# EAGLE design OpAmpBreakout-fragmentC (EAGLE 6.4)
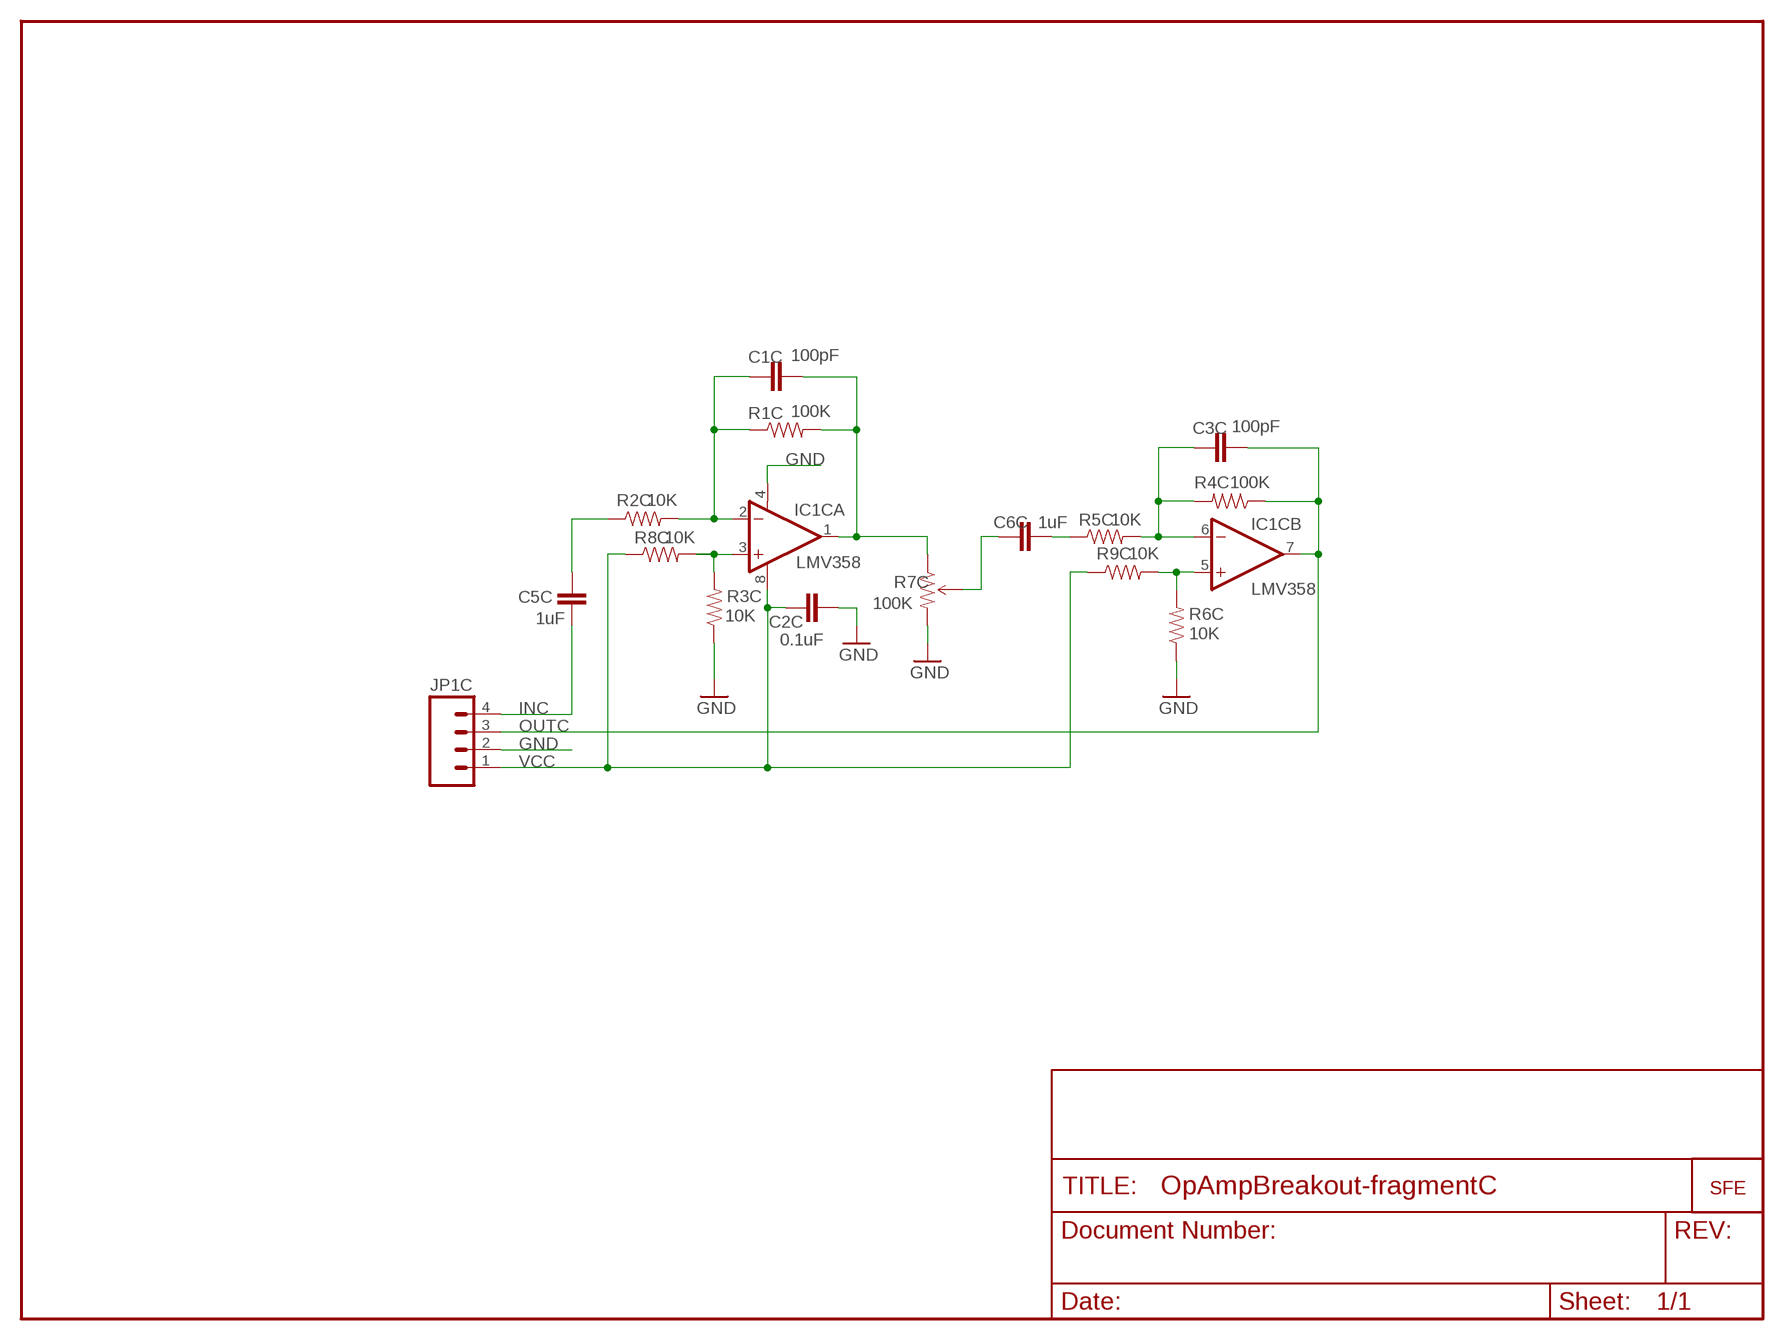
[diagram p0: schematic, sheet 1]

## Parts
C1C  100pF  CAP0402  [C0402]
C2C  0.1uF  CAP0402  [C0402]
C3C  100pF  CAP0402  [C0402]
C5C  1uF  CAP0402  [C0402]
C6C  1uF  CAP0402  [C0402]
IC1C  LMV358  OPAMP-DUALU  [SO08]
JP1C  M04PTH  [1X04]
R1C  100K  RESISTOR0402  [C0402]
R2C  10K  RESISTOR0402  [C0402]
R3C  10K  RESISTOR0402  [C0402]
R4C  100K  RESISTOR0402  [C0402]
R5C  10K  RESISTOR0402  [C0402]
R6C  10K  RESISTOR0402  [C0402]
R7C  100K  TRIMPOTSMD  [TRIMPOT-3MM]
R8C  10K  RESISTOR0402  [C0402]
R9C  10K  RESISTOR0402  [C0402]
U$3C  LOGO-SFENEW  [SFE-NEW-WEBLOGO]

## Nets
GND: C2C.2 IC1C.4(A:V-) JP1C.2 R3C.1 R6C.1 R7C.3(CW)
IN1C: C5C.2 R2C.1
INC: C5C.1 JP1C.4
N$1C: IC1C.5(B:+IN) R6C.2 R9C.2
N$2C: C1C.1 IC1C.2(A:-IN) R1C.1 R2C.2
N$3C: IC1C.3(A:+IN) R3C.2 R8C.2
N$4C: C6C.1 R5C.1
N$5C: C6C.2 R7C.2(WIPER)
N$7C: C3C.1 IC1C.6(B:-IN) R4C.2 R5C.2
OUT1C: C1C.2 IC1C.1(A:OUT) R1C.2 R7C.1(CCW)
OUTC: C3C.2 IC1C.7(B:OUT) JP1C.3 R4C.1
VCC: C2C.1 IC1C.8(A:V+) JP1C.1 R8C.1 R9C.1

## Library data of the parts
C1C C2C C3C C5C C6C = SparkFun:CAP: Capacitor Standard 0603 ceramic capacitor, and 0.1" leaded capacitor.
IC1C = SparkFun:OPAMP-DUAL: Operational Amplifier
JP1C = SparkFun:M04: Header 4 Standard 4-pin 0.1" header. Use with straight break away headers (SKU : PRT-00116), right angle break away headers (PRT-00553), swiss pins (PRT-00743), machine pins (PRT-00117), and female headers (PRT-00115). Molex polarized connector foot print use with SKU : PRT-08231 with associated crimp pins and housings.
R1C R2C R3C R4C R5C R6C = SparkFun:RESISTOR: Resistor Basic schematic elements and footprints for 0603, 1206, and PTH 1/10th watt (small) resistors.
R7C = SparkFun:TRIMPOT
R8C R9C = SparkFun-DC:RESISTOR: Resistor Basic schematic elements and footprints for 0603, 1206, and PTH 1/10th watt (small) resistors.
U$3C = SparkFun:LOGO-SFE: Spark Fun Electronics PCB Logo This is the standard Spark Fun Electronics PCB logo.

## Board
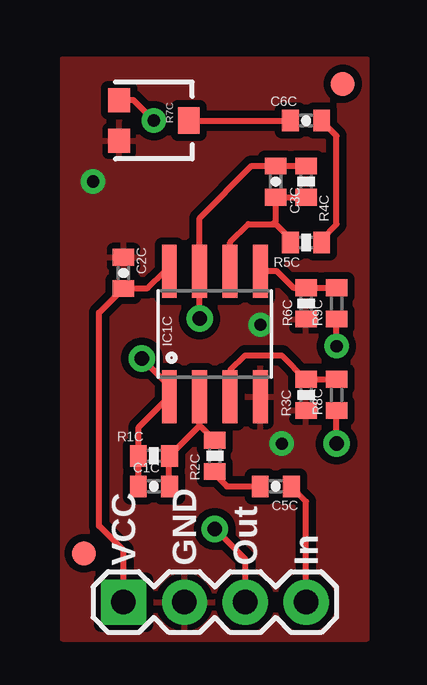
[diagram p1: board, top side]
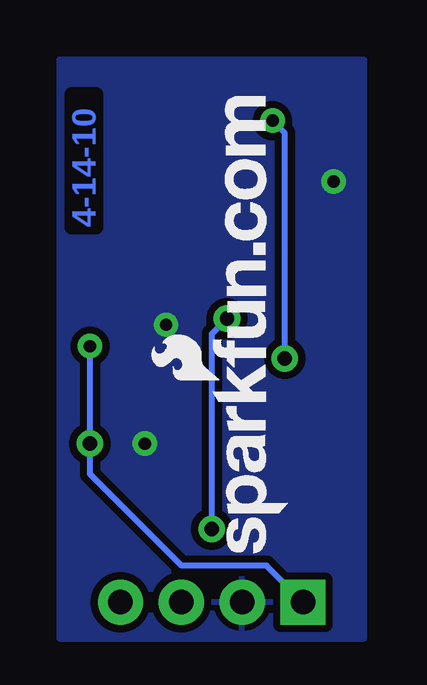
[diagram p2: board, bottom side, seen from below]

No outline drawn. Coordinates in mm, seen from the top.
Copper layers (1*16): Top 0.035mm / dielectric 1.5mm / Bottom 0.035mm
Design rules "SparkFun": minimum track width 8mil, minimum drill 20mil, track to track 8mil, track to pad 8mil, pad to pad 8mil, via to via 8mil, smd to smd 8mil, copper to edge 10mil, drill to drill 8mil, minimum pad ring 12mil, minimum via ring 10mil, stop-mask expansion 4mil, vias tented up to drill 25mil, thermal gap 10mil

### Footprints (pad centres in the part's own frame; a part is rotated, then mirrored left to right if it is on the bottom)
0402-CAP = smd 0.7 x 0.9: 1 -0.65,0; 2 0.65,0
FIDUCIAL-1X2 = smd 1 x 1: 1 0,0
SO08 = smd 0.61 x 2.21: 1 -1.905,-2.616; 2 -0.635,-2.616; 3 0.635,-2.616; 4 1.905,-2.616; 5 1.905,2.616; 6 0.635,2.616; 7 -0.635,2.616; 8 -1.905,2.616
1X04 = drill 1.016 pad 1.88 square: 1 0,0 | drill 1.016 pad 1.88: 2 2.54,0; 3 5.08,0; 4 7.62,0
0402-RES = smd 0.7 x 0.9: 1 -0.65,0; 2 0.65,0
TRIMPOT-3MM = smd 1 x 0.9: 1 -0.85,-1.45; 3 0.85,-1.45 | smd 1.1 x 0.9: 2 0,1.45
C0402 = smd 0.7 x 0.9: 1 -0.65,0; 2 0.65,0

### Placement (x,y rotation side)
C1C  100pF  [0402-CAP]  3.81,6.35 180 top
C2C  0.1uF  [0402-CAP]  2.54,15.24 90 top
C3C  100pF  [0402-CAP]  8.89,19.05 90 top
C5C  1uF  [0402-CAP]  8.89,6.35 180 top
C6C  1uF  [0402-CAP]  10.16,21.59 180 top
E$1C  [FIDUCIAL-1X2]  11.68,23.11 0 top
E$2C  [FIDUCIAL-1X2]  0.89,3.56 0 top
IC1C  6.35,12.7 0 top
JP1C  2.54,1.52 0 top
R1C  100K  [0402-RES]  3.81,7.62 180 top
R2C  10K  [0402-RES]  6.35,7.62 90 top
R3C  10K  [0402-RES]  10.16,10.16 90 top
R4C  100K  [0402-RES]  10.16,19.05 270 top
R5C  10K  [0402-RES]  10.16,16.51 180 top
R6C  10K  [0402-RES]  10.16,13.97 90 top
R7C  3.81,21.59 270 top
R8C  11.43,10.16 90 top
R9C  11.43,13.97 90 top
U$3C  3.17,3.57 90 bottom

### Tracks (layer width: path | path; a pad name or v marks a point on that pad's centre or on a via)
GND  (via drill 0.51)
  other vias: 1.27,19.05 8.26,13.08 9.14,8.13
  pour Top (isolate 0.305): 0,0 12.7,0 12.7,24.13 0,24.13
  pour Bottom (isolate 0.305): 0,0 12.7,0 12.7,24.13 0,24.13
  pour Bottom (isolate 0.305): 0,0 0,24.13 12.7,24.13 12.7,0
IN1C
  Top 0.254: R2C.1 6.35,6.86 6.86,6.35 C5C.2
INC
  Top 0.254: C5C.1 9.53,6.35 10.16,5.71 JP1C.4
N$1C
  Top 0.254: R6C.2 10.05,14.62 10.03,14.61 | R6C.2 R9C.2 | IC1C.5 8.94,15.32 9.65,14.61 9.91,14.61 10.03,14.73 10.14,14.62 R6C.2
N$2C
  Top 0.254: 6.06,8.17 R2C.2 6.35,8.26 5.71,8.89 | 5.71,8.89 IC1C.2 | 5.71,8.89 5.71,8.88 R1C.1 4.45,7.62 4.45,6.37 C1C.1
N$3C
  Top 0.254: R3C.2 10.05,10.81 10.03,10.79 | R3C.2 R8C.2 | IC1C.3 6.99,11.18 7.62,11.81 9.14,11.81 10.16,10.79 R3C.2
N$4C
  Top 0.254: R5C.1 10.81,16.65 11.43,17.27 11.43,20.95 10.79,21.59 C6C.1
N$5C
  Top 0.254: R7C.2 C6C.2
N$7C
  Top 0.254: IC1C.6 6.99,16.51 7.75,17.27 8.76,17.27 | R5C.2 9.51,16.62 9.53,16.64 8.89,17.27 8.76,17.27 | 8.76,17.27 8.89,17.4 C3C.1 10.14,18.4 10.16,18.41 R4C.2
OUT1C  (via drill 0.51, 0.6)
  Top 0.254: C1C.2 3.17,6.35 3.17,7.61 R1C.2 3.17,7.62 3.17,8.81 IC1C.1 4.45,10.54 v3.3,11.68 | v3.81,21.59 2.96,22.44 R7C.1
  Bottom 0.254: v3.3,11.68 3.3,21.08 v3.81,21.59
OUTC  (via drill 0.6)
  Top 0.254: R4C.1 8.9,19.7 8.89,19.68 C3C.2 7.89,19.7 5.71,17.53 IC1C.7 v5.71,13.34 | JP1C.3 7.62,3.3 v6.35,4.57
  Bottom 0.254: v6.35,4.57 6.35,12.7 v5.71,13.34
VCC  (via drill 0.51, 0.6)
  Top 0.254: 11.43,13.21 11.36,13.21 R9C.1 | v11.43,8.13 11.43,9.65 11.36,9.65 R8C.1 | JP1C.1 2.54,3.68 1.52,4.7 1.52,13.59 2.54,14.61 | IC1C.8 4.27,15.32 3.56,14.61 2.54,14.61 | 2.54,14.61 C2C.1 | R9C.1 11.43,13.34 | v11.43,12.19 R9C.1
  Bottom 0.254: JP1C.1 4.06,3.05 7.62,3.05 11.43,6.86 v11.43,8.13 v11.43,12.19

### Text on the board
Bottom: 4-14-10
tPlace: VCC | GND | Out | In
tValues: 100K trimpot | LMV358